# Altium schematic sheet Kasli_BP_Adapter.SchDoc: =ProjectName
size 420 x 297 mm; Author: P.K.; CompanyName: WUT; DrawnBy: P.K.; Organization: WUT ISE; Address1: Warsaw Univeristy of Technology; Address2: Nowowiejska 15/19; DocumentNumber: 1; Revision: 1.0; SheetNumber: 1; SheetTotal: 1; EDA_Number: ARTIQ; Projet: ARTIQ/SINARA; ModifiedBy: -; CreateDate: 05/02/2018; CheckedDate: -; Title2: Kasli_BP_Adapter.SchDoc; DivGrp: ISE; Designer: P.K.; ModifiedDate: -; ProjectName: ARTIQ/SINARA
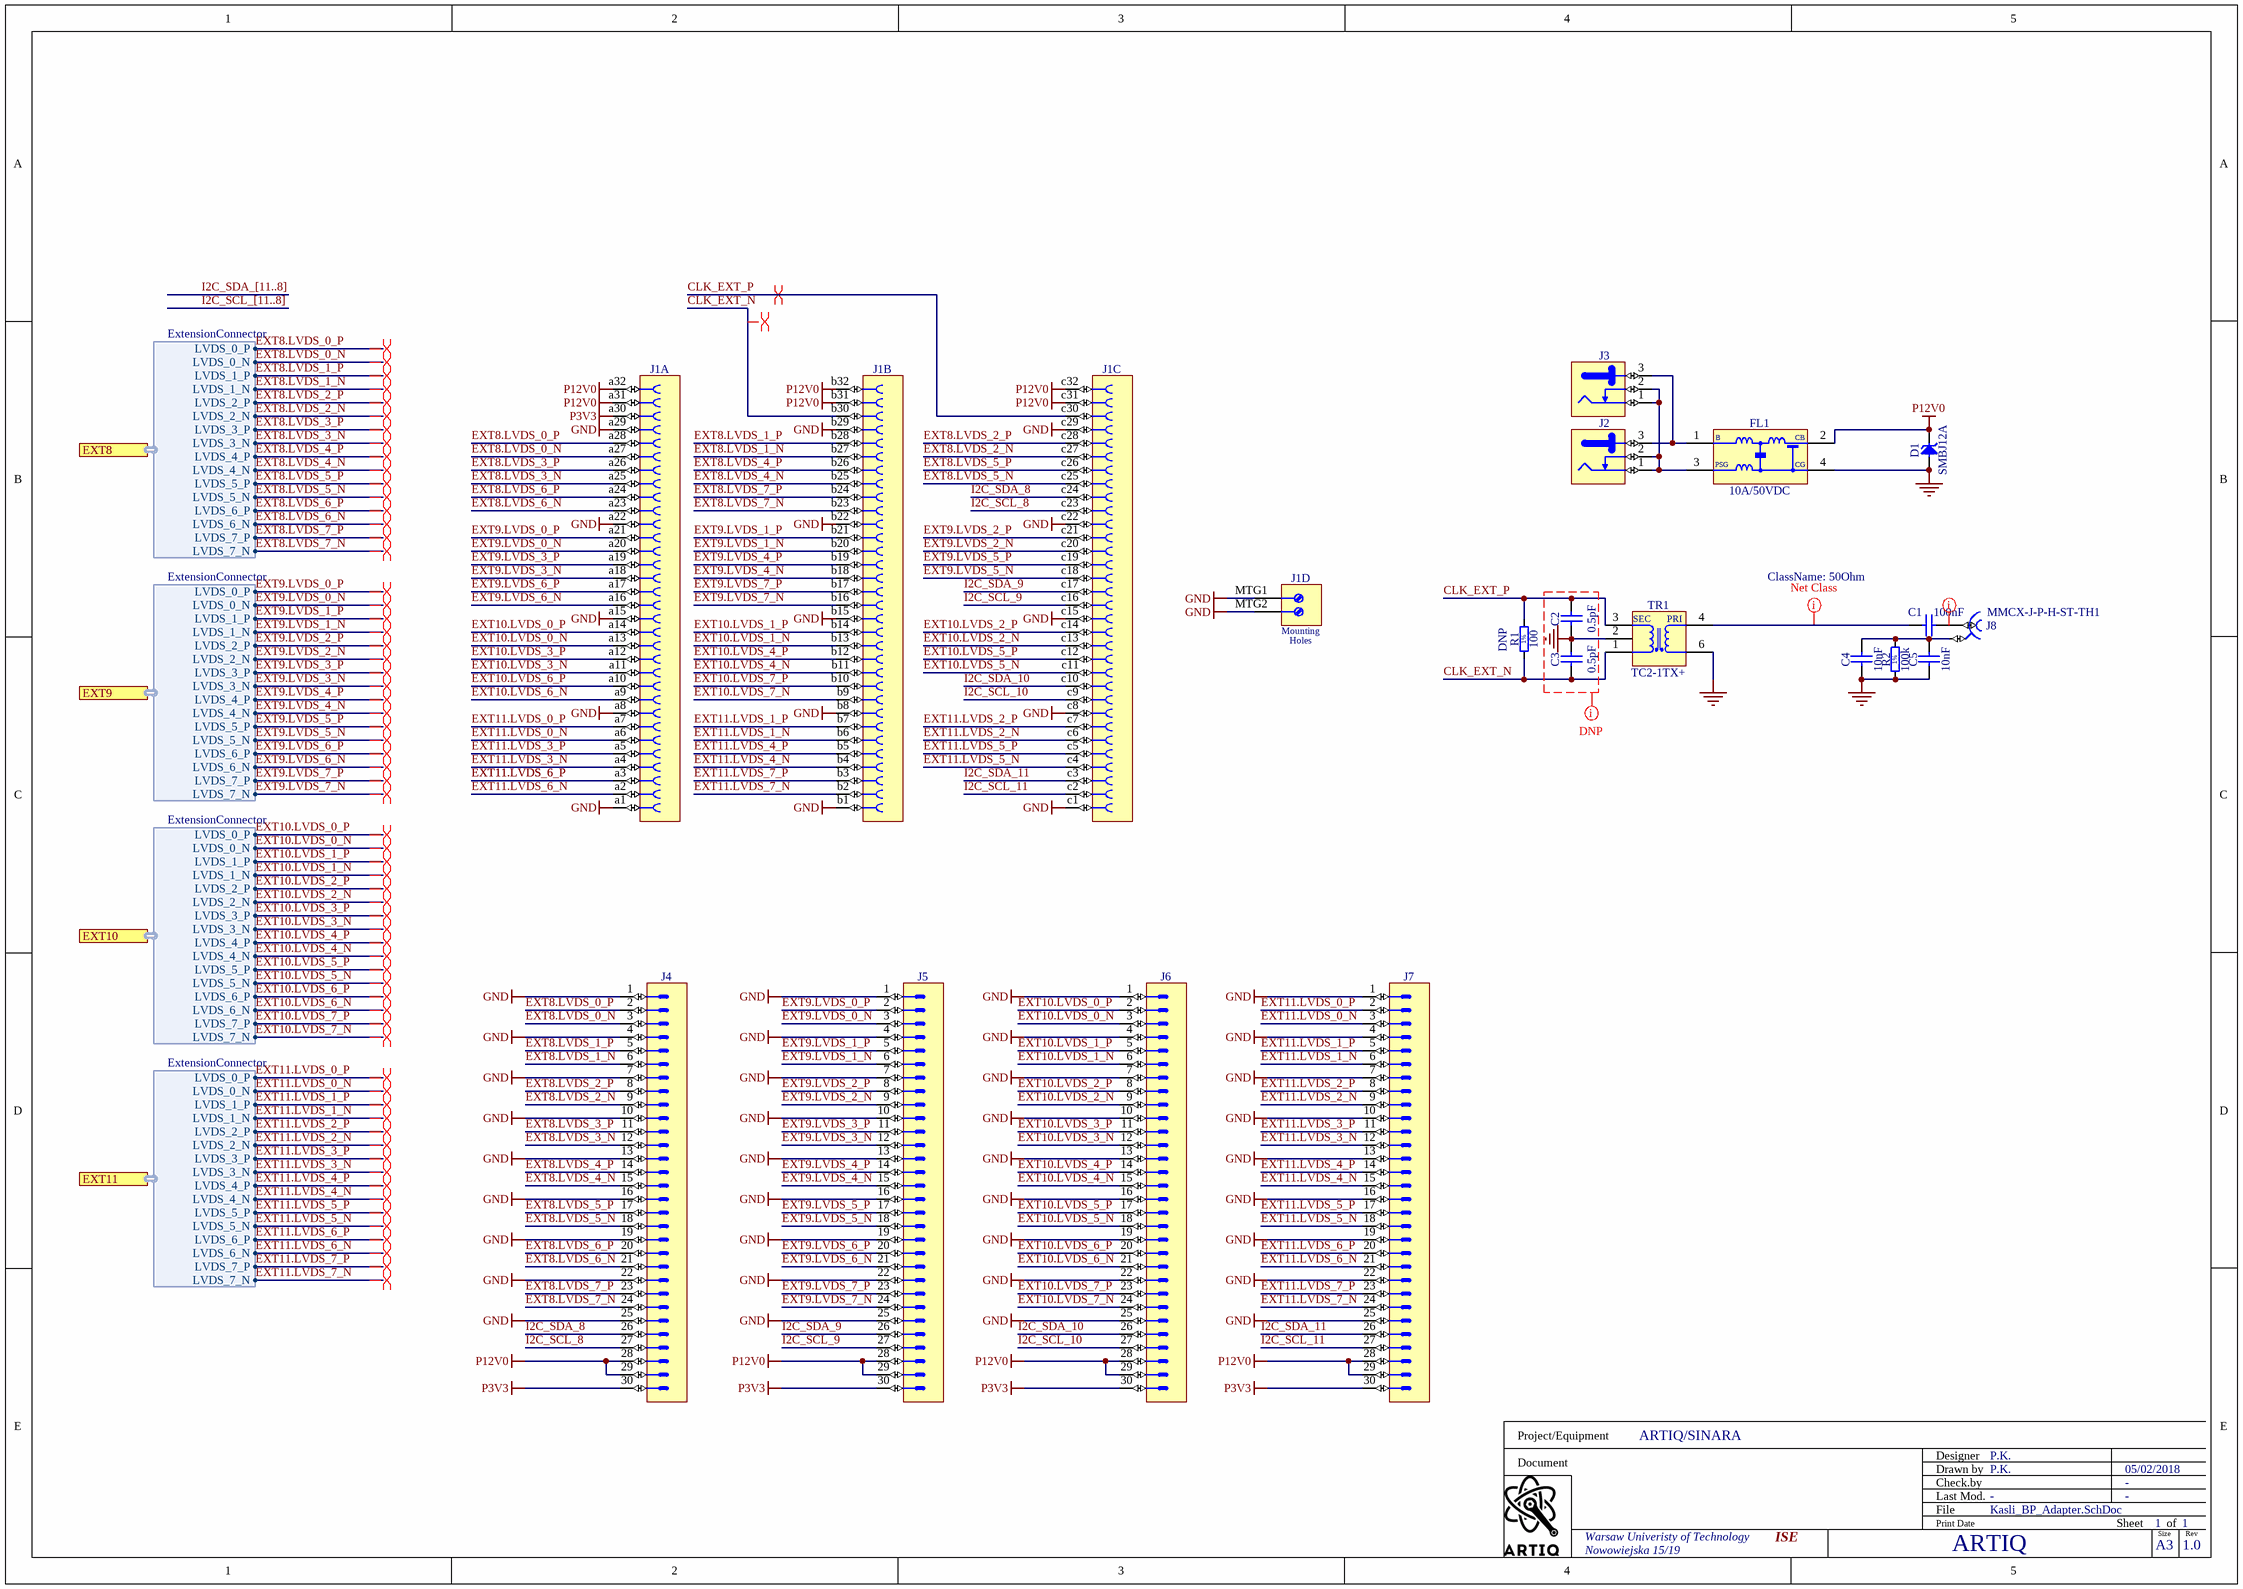
[diagram p0: Kasli_BP_Adapter.SchDoc]

## Parts
C1  100nF  [CAPC0603X33N]
C2  0.5pF  [CAPC1005X50N]
C3  0.5pF  [CAPC1005X50N]
C4  10nF  [CAPC1005X55N]
C5  10nF  [CAPC1005X55N]
D1  SMBJ12A  [DIOM5336X265N]
FL1  10A/50VDC  [FIL_MURATA_BNX02]
J1  DIN 41612 Type R  [HARTING_09 73 296 6801]  (value not drawn)  (parts A,B,C,D of 4)
J2  Jack  [SWITCHCRAFT_L712RA]  (value not drawn)
J3  Jack  [SWITCHCRAFT_L712RA]  (value not drawn)
J4  (no value)  [3M_N2530-6002RB]
J5  (no value)  [3M_N2530-6002RB]
J6  (no value)  [3M_N2530-6002RB]
J7  (no value)  [3M_N2530-6002RB]
J8  MMCX-J-P-H-ST-TH1  [SAMTEC_MMCX-J-P-H-ST-TH1]
R1  100  [RESC1005X40N]
R2  100k  [RESC1005X40N]
TR1  TC2-1TX+  [XFMR_MINI-CIRCUITS_AT1521]

## Ports
EXT8 (harness ExtensionConnector), EXT9 (harness ExtensionConnector), EXT10 (harness ExtensionConnector), EXT11 (harness ExtensionConnector)

## Harnesses
ExtensionConnector: LVDS_0_N, LVDS_0_P, LVDS_1_N, LVDS_1_P, LVDS_2_N, LVDS_2_P, LVDS_3_N, LVDS_3_P, LVDS_4_N, LVDS_4_P, LVDS_5_N, LVDS_5_P, LVDS_6_N, LVDS_6_P, LVDS_7_N, LVDS_7_P

## Nets
GND: C2.1 C3.2 C4.1 C5.1 D1.2(A) FL1.4(CG) J1.a1 J1.a8 J1.a15 J1.a22 J1.a29 J1.b1 J1.b8 J1.b15 J1.b22 J1.b29 J1.c1 J1.c8 J1.c15 J1.c22 J1.c29 J1.MTG1 J1.MTG2 J4.1 J4.4 J4.7 J4.10 J4.13 J4.16 J4.19 J4.22 J4.25 J5.1 J5.4 J5.7 J5.10 J5.13 J5.16 J5.19 J5.22 J5.25 J6.1 J6.4 J6.7 J6.10 J6.13 J6.16 J6.19 J6.22 J6.25 J7.1 J7.4 J7.7 J7.10 J7.13 J7.16 J7.19 J7.22 J7.25 R2.1 TR1.2(NU) TR1.6(PDOT)
P3V3: J1.a30 J4.30 J5.30 J6.30 J7.30
P12V0: D1.1(C) FL1.2(CB) J1.a31 J1.a32 J1.b31 J1.b32 J1.c31 J1.c32 J4.28 J4.29 J5.28 J5.29 J6.28 J6.29 J7.28 J7.29
CLK_EXT_N: C3.1 J1.b30 R1.1 TR1.1(SDOT)
CLK_EXT_P: C2.2 J1.c30 R1.2 TR1.3(S)
EXT8.LVDS_0_N: J1.a27 J4.3 ; port EXT8.LVDS_0_N
EXT8.LVDS_0_P: J1.a28 J4.2 ; port EXT8.LVDS_0_P
EXT8.LVDS_1_N: J1.b27 J4.6 ; port EXT8.LVDS_1_N
EXT8.LVDS_1_P: J1.b28 J4.5 ; port EXT8.LVDS_1_P
EXT8.LVDS_2_N: J1.c27 J4.9 ; port EXT8.LVDS_2_N
EXT8.LVDS_2_P: J1.c28 J4.8 ; port EXT8.LVDS_2_P
EXT8.LVDS_3_N: J1.a25 J4.12 ; port EXT8.LVDS_3_N
EXT8.LVDS_3_P: J1.a26 J4.11 ; port EXT8.LVDS_3_P
EXT8.LVDS_4_N: J1.b25 J4.15 ; port EXT8.LVDS_4_N
EXT8.LVDS_4_P: J1.b26 J4.14 ; port EXT8.LVDS_4_P
EXT8.LVDS_5_N: J1.c25 J4.18 ; port EXT8.LVDS_5_N
EXT8.LVDS_5_P: J1.c26 J4.17 ; port EXT8.LVDS_5_P
EXT8.LVDS_6_N: J1.a23 J4.21 ; port EXT8.LVDS_6_N
EXT8.LVDS_6_P: J1.a24 J4.20 ; port EXT8.LVDS_6_P
EXT8.LVDS_7_N: J1.b23 J4.24 ; port EXT8.LVDS_7_N
EXT8.LVDS_7_P: J1.b24 J4.23 ; port EXT8.LVDS_7_P
EXT9.LVDS_0_N: J1.a20 J5.3 ; port EXT9.LVDS_0_N
EXT9.LVDS_0_P: J1.a21 J5.2 ; port EXT9.LVDS_0_P
EXT9.LVDS_1_N: J1.b20 J5.6 ; port EXT9.LVDS_1_N
EXT9.LVDS_1_P: J1.b21 J5.5 ; port EXT9.LVDS_1_P
EXT9.LVDS_2_N: J1.c20 J5.9 ; port EXT9.LVDS_2_N
EXT9.LVDS_2_P: J1.c21 J5.8 ; port EXT9.LVDS_2_P
EXT9.LVDS_3_N: J1.a18 J5.12 ; port EXT9.LVDS_3_N
EXT9.LVDS_3_P: J1.a19 J5.11 ; port EXT9.LVDS_3_P
EXT9.LVDS_4_N: J1.b18 J5.15 ; port EXT9.LVDS_4_N
EXT9.LVDS_4_P: J1.b19 J5.14 ; port EXT9.LVDS_4_P
EXT9.LVDS_5_N: J1.c18 J5.18 ; port EXT9.LVDS_5_N
EXT9.LVDS_5_P: J1.c19 J5.17 ; port EXT9.LVDS_5_P
EXT9.LVDS_6_N: J1.a16 J5.21 ; port EXT9.LVDS_6_N
EXT9.LVDS_6_P: J1.a17 J5.20 ; port EXT9.LVDS_6_P
EXT9.LVDS_7_N: J1.b16 J5.24 ; port EXT9.LVDS_7_N
EXT9.LVDS_7_P: J1.b17 J5.23 ; port EXT9.LVDS_7_P
EXT10.LVDS_0_N: J1.a13 J6.3 ; port EXT10.LVDS_0_N
EXT10.LVDS_0_P: J1.a14 J6.2 ; port EXT10.LVDS_0_P
EXT10.LVDS_1_N: J1.b13 J6.6 ; port EXT10.LVDS_1_N
EXT10.LVDS_1_P: J1.b14 J6.5 ; port EXT10.LVDS_1_P
EXT10.LVDS_2_N: J1.c13 J6.9 ; port EXT10.LVDS_2_N
EXT10.LVDS_2_P: J1.c14 J6.8 ; port EXT10.LVDS_2_P
EXT10.LVDS_3_N: J1.a11 J6.12 ; port EXT10.LVDS_3_N
EXT10.LVDS_3_P: J1.a12 J6.11 ; port EXT10.LVDS_3_P
EXT10.LVDS_4_N: J1.b11 J6.15 ; port EXT10.LVDS_4_N
EXT10.LVDS_4_P: J1.b12 J6.14 ; port EXT10.LVDS_4_P
EXT10.LVDS_5_N: J1.c11 J6.18 ; port EXT10.LVDS_5_N
EXT10.LVDS_5_P: J1.c12 J6.17 ; port EXT10.LVDS_5_P
EXT10.LVDS_6_N: J1.a9 J6.21 ; port EXT10.LVDS_6_N
EXT10.LVDS_6_P: J1.a10 J6.20 ; port EXT10.LVDS_6_P
EXT10.LVDS_7_N: J1.b9 J6.24 ; port EXT10.LVDS_7_N
EXT10.LVDS_7_P: J1.b10 J6.23 ; port EXT10.LVDS_7_P
EXT11.LVDS_0_N: J1.a6 J7.3 ; port EXT11.LVDS_0_N
EXT11.LVDS_0_P: J1.a7 J7.2 ; port EXT11.LVDS_0_P
EXT11.LVDS_1_N: J1.b6 J7.6 ; port EXT11.LVDS_1_N
EXT11.LVDS_1_P: J1.b7 J7.5 ; port EXT11.LVDS_1_P
EXT11.LVDS_2_N: J1.c6 J7.9 ; port EXT11.LVDS_2_N
EXT11.LVDS_2_P: J1.c7 J7.8 ; port EXT11.LVDS_2_P
EXT11.LVDS_3_N: J1.a4 J7.12 ; port EXT11.LVDS_3_N
EXT11.LVDS_3_P: J1.a5 J7.11 ; port EXT11.LVDS_3_P
EXT11.LVDS_4_N: J1.b4 J7.15 ; port EXT11.LVDS_4_N
EXT11.LVDS_4_P: J1.b5 J7.14 ; port EXT11.LVDS_4_P
EXT11.LVDS_5_N: J1.c4 J7.18 ; port EXT11.LVDS_5_N
EXT11.LVDS_5_P: J1.c5 J7.17 ; port EXT11.LVDS_5_P
EXT11.LVDS_6_N: J1.a2 J7.21 ; port EXT11.LVDS_6_N
EXT11.LVDS_6_P: J1.a3 J7.20 ; port EXT11.LVDS_6_P
EXT11.LVDS_7_N: J1.b2 J7.24 ; port EXT11.LVDS_7_N
EXT11.LVDS_7_P: J1.b3 J7.23 ; port EXT11.LVDS_7_P
I2C_SCL_8: J1.c23 J4.27
I2C_SCL_9: J1.c16 J5.27
I2C_SCL_10: J1.c9 J6.27
I2C_SCL_11: J1.c2 J7.27
I2C_SDA_8: J1.c24 J4.26
I2C_SDA_9: J1.c17 J5.26
I2C_SDA_10: J1.c10 J6.26
I2C_SDA_11: J1.c3 J7.26
NetC1_1: C1.1 TR1.4(P)
NetC1_2: C1.2 J8.1
NetC4_2: C4.2 C5.2 J8.2 R2.2
NetFL1_1: FL1.1(B) J2.3 J3.3
NetFL1_3: FL1.3(PSG) J2.1 J2.2 J3.1 J3.2

## Buses and harness runs
bus I2C_SCL_[11..8]
bus I2C_SDA_[11..8]

## Layout directives
net class 50Ohm: NetC1_1, NetC1_2
rule Undefined: GND
differential pair; net class LVPECL: CLK_EXT_N, CLK_EXT_P
differential pair; net class Diff_100Ohm: EXT8.LVDS_0_N, EXT8.LVDS_0_P, EXT8.LVDS_1_N, EXT8.LVDS_1_P, EXT8.LVDS_2_N, EXT8.LVDS_2_P, EXT8.LVDS_3_N, EXT8.LVDS_3_P, EXT8.LVDS_4_N, EXT8.LVDS_4_P, EXT8.LVDS_5_N, EXT8.LVDS_5_P, EXT8.LVDS_6_N, EXT8.LVDS_6_P, EXT8.LVDS_7_N, EXT8.LVDS_7_P, EXT9.LVDS_0_N, EXT9.LVDS_0_P, EXT9.LVDS_1_N, EXT9.LVDS_1_P, EXT9.LVDS_2_N, EXT9.LVDS_2_P, EXT9.LVDS_3_N, EXT9.LVDS_3_P, EXT9.LVDS_4_N, EXT9.LVDS_4_P, EXT9.LVDS_5_N, EXT9.LVDS_5_P, EXT9.LVDS_6_N, EXT9.LVDS_6_P, EXT9.LVDS_7_N, EXT9.LVDS_7_P, EXT10.LVDS_0_N, EXT10.LVDS_0_P, EXT10.LVDS_1_N, EXT10.LVDS_1_P, EXT10.LVDS_2_N, EXT10.LVDS_2_P, EXT10.LVDS_3_N, EXT10.LVDS_3_P, EXT10.LVDS_4_N, EXT10.LVDS_4_P, EXT10.LVDS_5_N, EXT10.LVDS_5_P, EXT10.LVDS_6_N, EXT10.LVDS_6_P, EXT10.LVDS_7_N, EXT10.LVDS_7_P, EXT11.LVDS_0_N, EXT11.LVDS_0_P, EXT11.LVDS_1_N, EXT11.LVDS_1_P, EXT11.LVDS_2_N, EXT11.LVDS_2_P, EXT11.LVDS_3_N, EXT11.LVDS_3_P, EXT11.LVDS_4_N, EXT11.LVDS_4_P, EXT11.LVDS_5_N, EXT11.LVDS_5_P, EXT11.LVDS_6_N, EXT11.LVDS_6_P, EXT11.LVDS_7_N, EXT11.LVDS_7_P

## Notes on the sheet
- (near R1) DNP
- Project/Equipment
- Document
- Designer
- Drawn by
- Check.by
- File
- Last Mod.
- Print Date
- Sheet
- Size
- A3
- of
- Rev
- (in symbol HARTING_09 73 296 6801, part D) Mounting; Holes
- (in symbol R0402_100K_1%_0.0625W_100PPM) 1%
- (in symbol R0402_100R_1%_0.0625W_100PPM) 1%
- (in symbol XFMR_MINI-CIRCUITS_TC2-1TX+) SEC; PRI

## Library data of the parts
C1 = CC0201_100NF_6.3V_10%_X5R: Non-polarised capacitor; Part Description: SMD Multilayer Chip Ceramic Capacitor; Manufacturer: GENERIC; Manufacturer1 Part Number: 02016D104KAT2A; Voltage: 6.3V; TC: X5R; Tolerance: ±10%; Part Number: CC0201_100NF_6.3V_10%_X5R; Component Kind: Standard; Component Type: Standard; Pin Count: 2; Value: 100nF; Status: Not Recommended; Manufacturer Part Number: CC0201_100NF_6.3V_10%_X5R; Case: 0201; Mounted: Yes; Socket: No; SMD: Yes; Sense: No; Manufacturer1 Example: AVX; Manufacturer1 ComponentHeight: 0.33mm; HelpURL: \\cern.ch\dfs\Applications\Altium\Datasheets\CC0201_X5R_AVX.pdf; Author: CERN DEM JLC; CreateDate: 2007-12-03; LatestRevisionDate: 2007-12-03
C2 C3 = CC0402_0.5PF_25V_0.05PF_AVX_04023J0R5ABSTR: Non-polarised capacitor; Part Description: Thin-Film Chip Capacitors for RF Signal and Power Applications, Accu-P Series; Manufacturer: AVX; Voltage: 25V; Tolerance: ±0.05pF; Part Number: CC0402_0.5PF_25V_0.05PF_AVX_04023J0R5ABSTR; Component Kind: Standard; Component Type: Standard; Pin Count: 2; Value: 0.5pF; Status: None; Manufacturer Part Number: 04023J0R5ABSTR; Case: 0402; Mounted: Yes; Socket: No; SMD: Yes; Sense: No; ComponentHeight: 0.5mm; HelpURL: \\cern.ch\dfs\Applications\Altium\Datasheets\CC0402_AVX_ACCU-P.pdf; Author: CERN DEM JLC; CreateDate: 2017-02-22; LatestRevisionDate: 2017-02-22
C4 C5 = CC0402_10NF_16V_10%_X7R: Non-polarised capacitor; Part Description: SMD Multilayer Chip Ceramic Capacitor; Manufacturer: GENERIC; Manufacturer1 Part Number: 223878715636; Voltage: 16V; TC: X7R; Tolerance: ±10%; Part Number: CC0402_10NF_16V_10%_X7R; Component Kind: Standard; Component Type: Standard; Pin Count: 2; Value: 10nF; Status: Not Recommended; Manufacturer Part Number: CC0402_10NF_16V_10%_X7R; Case: 0402; Mounted: Yes; Socket: No; SMD: Yes; Sense: No; Manufacturer1 Example: PHYCOMP; Manufacturer1 ComponentHeight: 0.55mm; HelpURL: \\cern.ch\dfs\Applications\Altium\Datasheets\CC0402_X7R_PHYCOMP.pdf; Author: CERN DEM JLC; CreateDate: 03.12.2007; LatestRevisionDate: 03.12.2007
D1 = SMBJ12A: Zener Diode; Part Description: Uni-Directional Transient Voltage Suppressor Diode; Manufacturer: FAIRCHILD SEMICONDUCTOR; Voltage: 12V; Power: 600W; PressFit: No; Bonding: No; Part Number: SMBJ12A; Component Kind: Standard; Component Type: Standard; Device: SMBJ12A; PackageDescription: DO-214-AA/SMB Diode, Molded Body; 5.34mm L X 3.625mm W X 2.65mm H, IPC Medium Density; Manufacturer Part Number: SMBJ12A; Pin Count: 2; Case: DO-214AA; Mounted: Yes; Socket: No; SMD: Yes; Sense: No; ComponentHeight: 2.65mm; HelpURL: \\cern.ch\dfs\Applications\Altium\Datasheets\SMBJ.pdf; Author: CERN DEM JLC; CreateDate: 10.04.2013; LatestRevisionDate: 10.04.2013
FL1 = FIL_MURATA_BNX022-01L: Block Type EMIFIL (LC Combined); Part Description: Block Type EMIFIL (LC Combined) SMD Type, BNX02* Series; Manufacturer: MURATA; Resistance: 0.5R; Part Number: FIL_MURATA_BNX022-01L; Component Kind: Standard; Component Type: Standard; Pin Count: 2; Value: 10A/50VDC; Status: None; Manufacturer Part Number: BNX022-01L; Mounted: Yes; Socket: No; SMD: Yes; Sense: No; ComponentHeight: 3.3mm; HelpURL: \\cern.ch\dfs\Applications\Altium\Datasheets\FIL_MURATA_BNX022-01L.pdf; Author: CERN DEM JLC; CreateDate: 10.10.2012; LatestRevisionDate: 10.10.2012
J1 = HARTING_09 73 296 6801: Connector 96abc Female (3x32); Part Description: DIN 41612, Type R, 96 Position, Rows a+b+c, Performance level 2, Right Angle Female Connector, Lead 3.0 mm, Pitch 2.54mm; PressFit: No; Part Number: HARTING_09 73 296 6801; Component Kind: Standard; Component Type: Standard; Pin Count: 98; Family: DIN 41612 Type R; Mounted: Yes; Socket: No; SMD: No; Sense: No; Status: None; Manufacturer: HARTING; Manufacturer Part Number: 09 73 296 6801; ComponentHeight: 9.5mm; HelpURL: \\cern.ch\dfs\Applications\Altium\Datasheets\HARTING_09 73 296 6801.pdf; Author: CERN DEM JLC; CreateDate: 22.07.2008; LatestRevisionDate: 22.07.2008
J2 J3 = CON_DC_5A_THT_RA: 24V /3. 5A, 2.1mm Diameter Pin, SMD DC Power Supply Connector With  Break Contact; Part Number: SWITCHCRAFT_712RA; Part Description: 12V/5A, 2.5mm Diameter Pin, THT DC Power Supply Connector With  Break Contact; Manufacturer: SWITCHCRAFT; Manufacturer Part Number: 712RA; PressFit: No; Component Kind: Standard; Component Type: Standard; Footprint: SWITCHCRAFT_712RA; Pin Count: 3; Family: Jack; Mounted: Yes; Socket: No; SMD: No; Sense: No; Status: None; ComponentHeight: 11mm; HelpURL: \\cern.ch\dfs\Applications\Altium\Datasheets\LUMBERG_161314.pdf; Author: GK; CreateDate: 15.02.2011; LatestRevisionDate: 20.07.2011; ClassName: Connectors
J4-J7 = 3M_N2530-6002RB: Connector 30 Male; Part Description: 30 Contacts - Straight .100'' x .100'' Low Profile Four-Wall Header, 2500 Series; Manufacturer: 3M; PressFit: No; Part Number: 3M_N2530-6002RB; Component Kind: Standard; Component Type: Standard; Pin Count: 30; Family: Header 30; Mounted: Yes; Socket: No; SMD: No; Sense: No; Status: None; Manufacturer Part Number: N2530-6002RB; ComponentHeight: 10.03mm; HelpURL: \\cern.ch\dfs\Applications\Altium\Datasheets\3M_N2530-6002RB.pdf; Author: CERN DEM JLC; CreateDate: 11.02.2009; LatestRevisionDate: 11.08.2009
J8 = SAMTEC_MMCX-J-P-H-ST-TH1: Part Description: Straight Through-hole 50 Ohm Micro Mini RF Jack, MMCX Series; Manufacturer: SAMTEC; PressFit: No; Part Number: SAMTEC_MMCX-J-P-H-ST-TH1; Component Kind: Standard; Component Type: Standard; Pin Count: 2; Mounted: Yes; Socket: No; Sense: No; SMD: No; Status: None; Manufacturer Part Number: MMCX-J-P-H-ST-TH1; ComponentHeight: 4.35mm; HelpURL: \\cern.ch\dfs\Applications\Altium\Datasheets\SAMTEC_MMCX-J-P-H-ST-TH1.pdf; Author: CERN DEM JLC; CreateDate: 05.12.2012; LatestRevisionDate: 05.12.2012
R1 = R0402_100R_1%_0.0625W_100PPM: Resistor - 1%; Part Description: General Purpose Thick Film Chip Resistor; Manufacturer: GENERIC; Manufacturer1 Part Number: 232270671001L; TC: ±100ppm/°C; PressFit: No; Part Number: R0402_100R_1%_0.0625W_100PPM; Component Kind: Standard; Component Type: Standard; Pin Count: 2; Value: 100; Status: Not Recommended; Power: 0.0625W; Tolerance: ±1%; Manufacturer Part Number: R0402_100R_1%_0.0625W_100PPM; Case: 0402; Mounted: Yes; Sense: No; Socket: No; SMD: Yes; Manufacturer1 Example: YAGEO PHYCOMP; Manufacturer1 ComponentHeight: 0.4mm; HelpURL: \\cern.ch\dfs\Applications\Altium\Datasheets\R0402_Phycomp_RC0402.pdf; Author: CERN DEM JLC; CreateDate: 03.12.2007; LatestRevisionDate: 17.10.2012
R2 = R0402_100K_1%_0.0625W_100PPM: Resistor - 1%; Part Description: General Purpose Thick Film Chip Resistor; Manufacturer: GENERIC; Manufacturer1 Part Number: 232270671004L; PressFit: No; TC: ±100ppm/°C; Part Number: R0402_100K_1%_0.0625W_100PPM; Component Kind: Standard; Component Type: Standard; Pin Count: 2; Value: 100k; Status: Not Recommended; Manufacturer Part Number: R0402_100K_1%_0.0625W_100PPM; Case: 0402; Mounted: Yes; Sense: No; Socket: No; SMD: Yes; Manufacturer1 Example: YAGEO PHYCOMP; Manufacturer1 ComponentHeight: 0.4mm; HelpURL: \\cern.ch\dfs\Applications\Altium\Datasheets\R0402_Phycomp_RC0402.pdf; Author: CERN DEM JLC; CreateDate: 03.12.2007; LatestRevisionDate: 17.10.2012; Power: 0.0625W; Tolerance: ±1%
TR1 = XFMR_MINI-CIRCUITS_TC2-1TX+: 50 Ohm 3 to 300MHz RF Transformers; Manufacturer: MINI-CIRCUITS; Manufacturer Part Number: TC2-1TX+; HelpURL: https://ww2.minicircuits.com/pdfs/TC2-1TX+.pdf